# EasyEDA Pro project RackEth_rev_2.eprj

# Schematic RackEth
Board Name: RackEth; Create Date: 2024-12-09; Page Name: RackEth; Project Name: RackEth; Schematic Name: RackEth; Update Date: 2025-01-21; Company: EasyEDA.com; Drawn: EasyEDA; Page Size: A4; Part Number: JLCPCB-002; Reviewed: EasyEDA; Version: V0.1
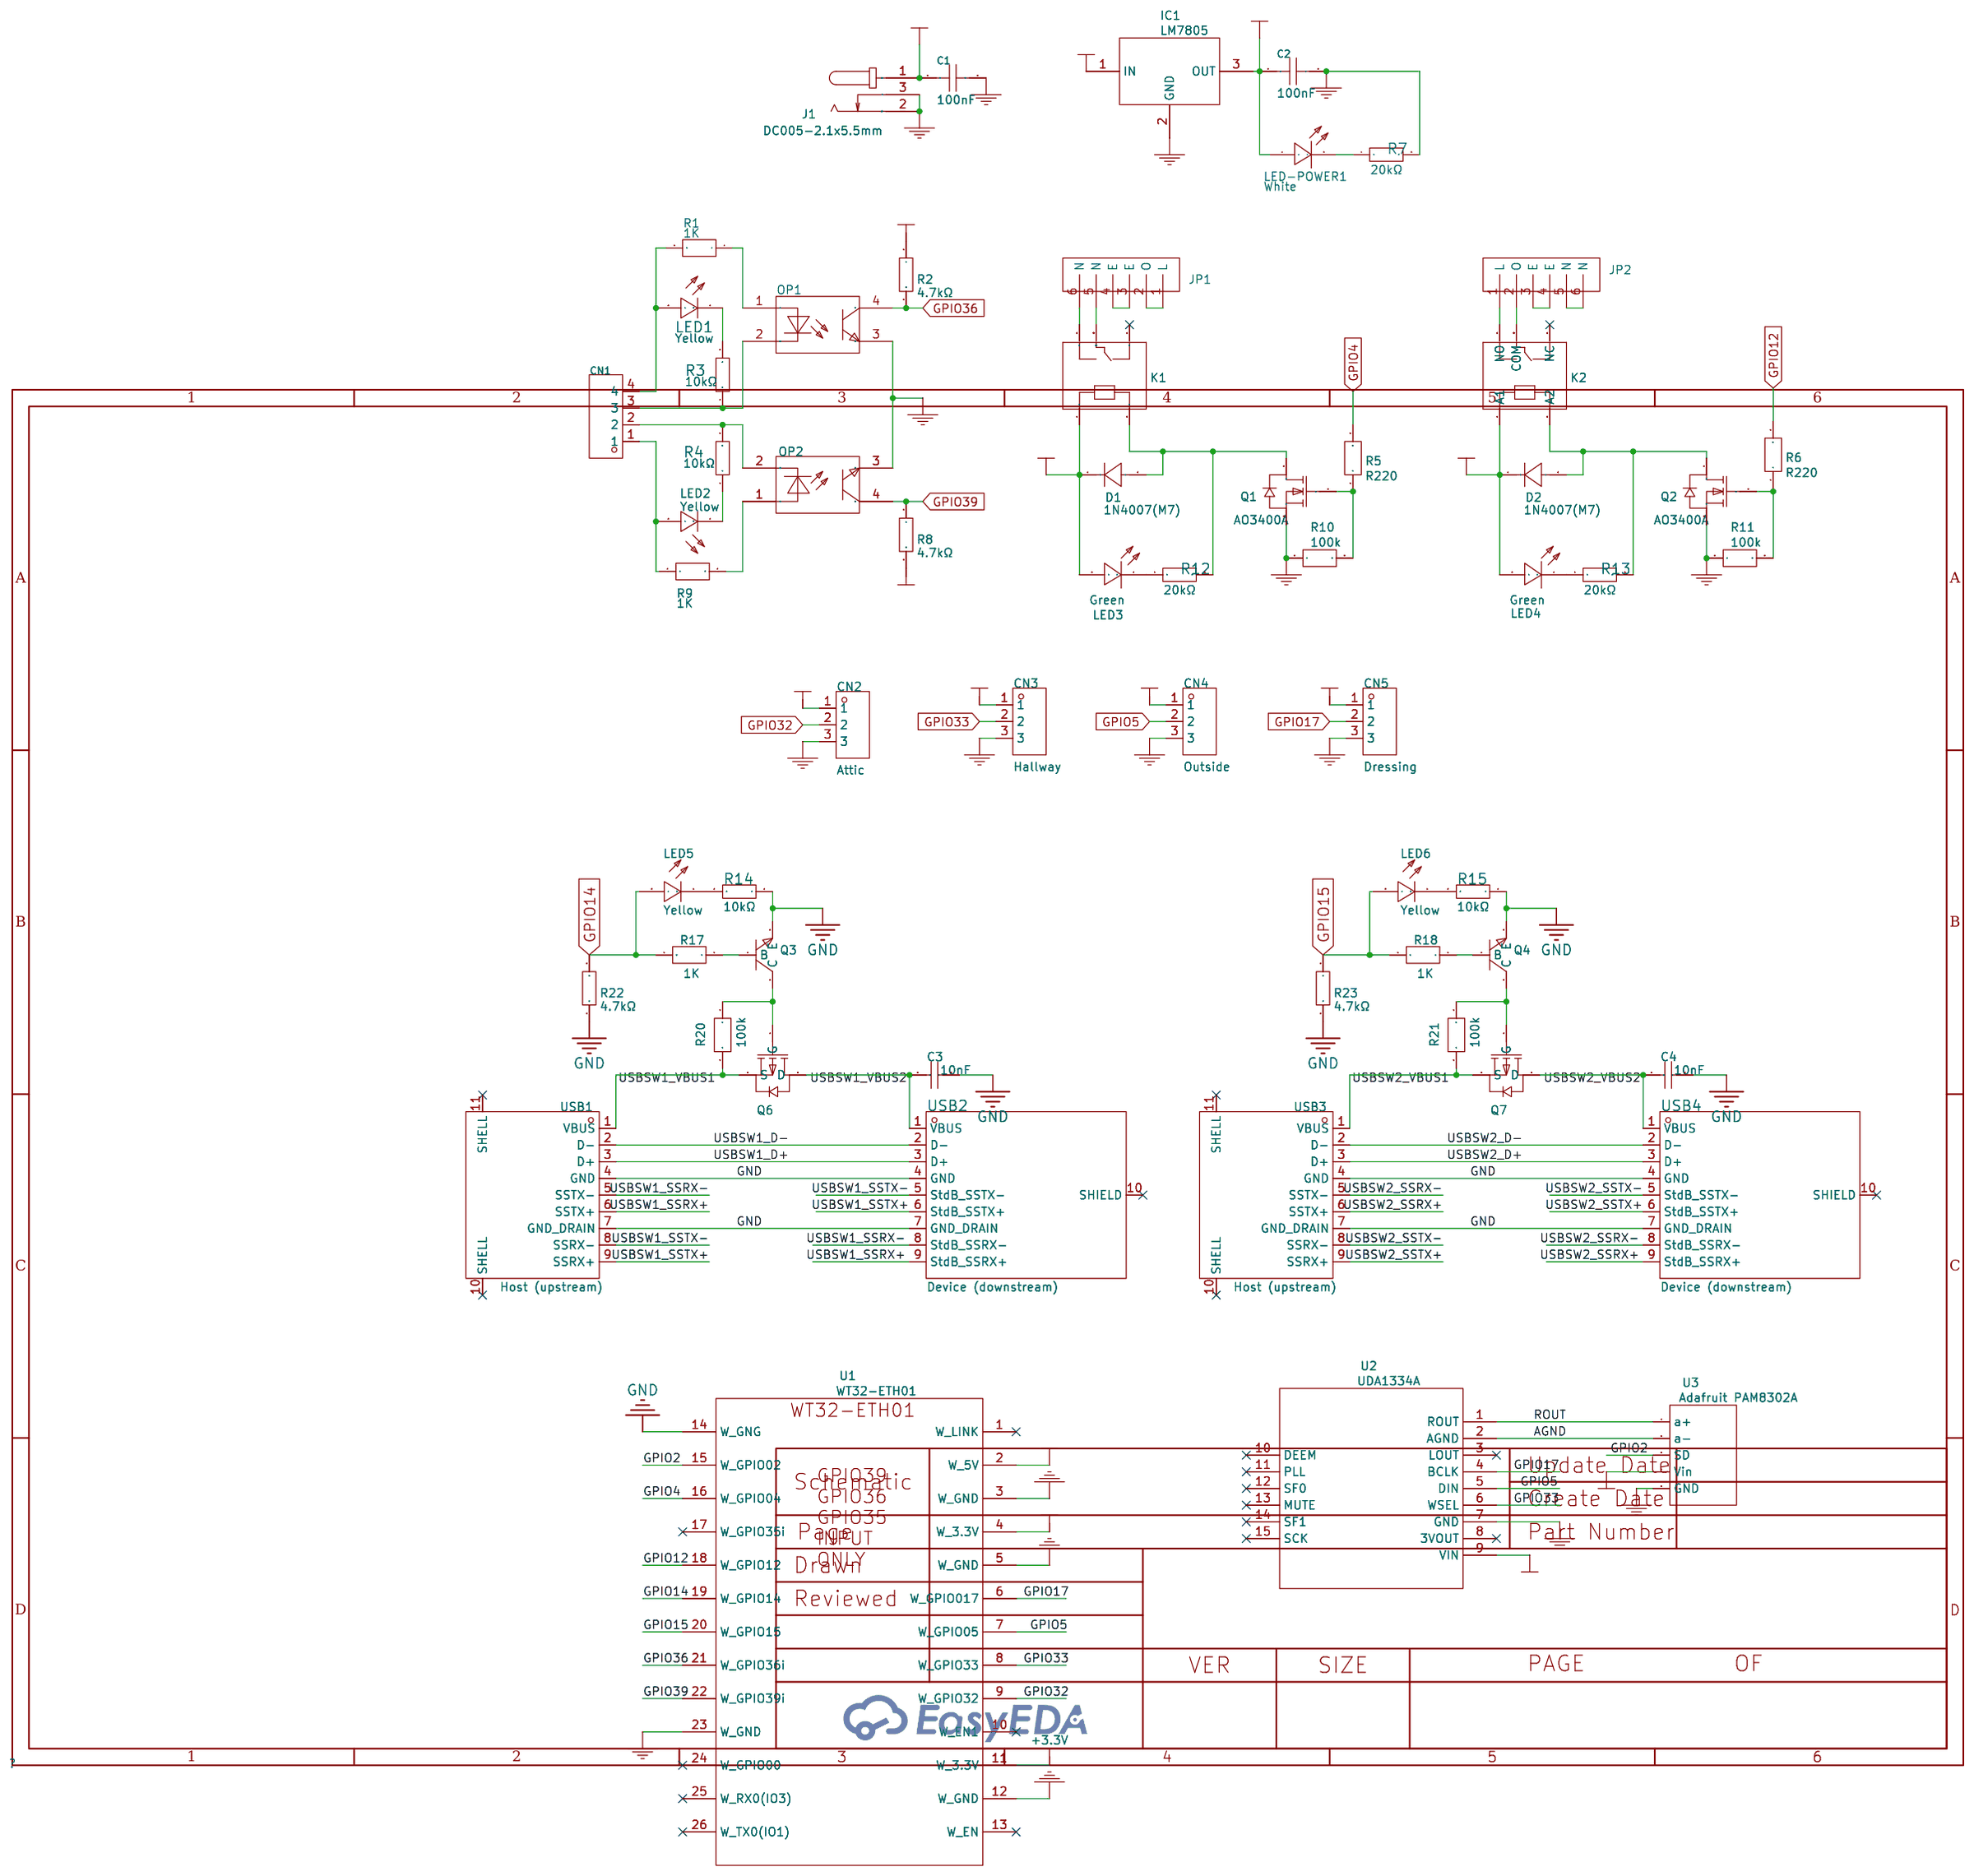
[diagram p0: schematic sheet]

## Parts
C1  100nF  [C0603]
C2  100nF  [C0603]
C3  10nF  [C0402]
C4  10nF  [C0402]
CN1  WJ127-5.0-4P  [CONN-TH_4P-P5.00_WJ127-5.0-4P]  (no BOM)
CN2  Attic  [CONN-TH_3P-P2.50_HCTL_XH-3A-L]  (no BOM)
CN3  Hallway  [CONN-TH_3P-P2.50_HCTL_XH-3A-L]  (no BOM)
CN4  Outside  [CONN-TH_3P-P2.50_HCTL_XH-3A-L]  (no BOM)
CN5  Dressing  [CONN-TH_3P-P2.50_HCTL_XH-3A-L]  (no BOM)
D1  1N4007(M7)  [SMA_L4.3-W2.7-LS5.1-RD]
D2  1N4007(M7)  [SMA_L4.3-W2.7-LS5.1-RD]
IC1  LM7805  [LM7805]  (no BOM)
J1  DC005-2.1x5.5mm  [DC-IN-TH_POWER-JACK]  (no BOM)
JP1  JP1  [CONN-TH_6P-P5.00_WJ127-5.0-6P]  (no BOM)
JP2  JP2  [CONN-TH_6P-P5.00_WJ127-5.0-6P]  (no BOM)
K1  Relay1  [SRD-05VDC-SL-C_RELAY_SRD-05VDC-SL-C]  (no BOM)
K2  Relay2  [SRD-05VDC-SL-C_RELAY_SRD-05VDC-SL-C]  (no BOM)
LED1  Yellow  [LED0603-RD-YELLOW]
LED2  Yellow  [LED0603-RD-YELLOW]
LED3  Green  [LED0805-RD_GREEN]
LED4  Green  [LED0805-RD_GREEN]
LED5  Yellow  [LED0603-RD-YELLOW]
LED6  Yellow  [LED0603-RD-YELLOW]
LED-POWER1  White  [LED0603-R-RD_WHITE]
OP1  EL817S1(C)(TU)-F  [OPTO-SMD-4_L4.6-W6.5-P2.54-LS10.3-TL]
OP2  EL817S1(C)(TU)-F  [OPTO-SMD-4_L4.6-W6.5-P2.54-LS10.3-TL]
Q1  AO3400A  [SOT-23-3_L2.9-W1.6-P1.90-LS2.8-BR]
Q2  AO3400A  [SOT-23-3_L2.9-W1.6-P1.90-LS2.8-BR]
Q3  MMBT3904(RANGE:100-300)  [SOT-23-3_L2.9-W1.3-P1.90-LS2.4-BR]
Q4  MMBT3904(RANGE:100-300)  [SOT-23-3_L2.9-W1.3-P1.90-LS2.4-BR]
Q6  AO3401A  [SOT-23_L2.9-W1.3-P1.90-LS2.4-BR]
Q7  AO3401A  [SOT-23_L2.9-W1.3-P1.90-LS2.4-BR]
R1  1K  [R0603]
R2  4.7kΩ  [R0603]
R3  10kΩ  [R0603]
R4  10kΩ  [R0603]
R5  R220  [R0603]
R6  R220  [R0603]
R7  20kΩ  [R0603]
R8  4.7kΩ  [R0603]
R9  1K  [R0603]
R10  100k  [R0603]
R11  100k  [R0603]
R12  20kΩ  [R0603]
R13  20kΩ  [R0603]
R14  10kΩ  [R0603]
R15  10kΩ  [R0603]
R17  1K  [R0603]
R18  1K  [R0603]
R20  100k  [R0603]
R21  100k  [R0603]
R22  4.7kΩ  [R0603]
R23  4.7kΩ  [R0603]
U1  WT32-ETH01  [WT32-ETH01-M]  (no BOM)
U2  UDA1334A  [UDA1334A_MODULE]  (no BOM)
U3  Adafruit PAM8302A  [ADAFRUIT PAM8302A]  (no BOM)
USB1  Host (upstream)  [USB3.0-TH_U235-09XN-2XC2-002]
USB2  Device (downstream)  [USB3.0-A-SMD_916-862A205EY10200]
USB3  Host (upstream)  [USB3.0-TH_U235-09XN-2XC2-002]
USB4  Device (downstream)  [USB3.0-A-SMD_916-862A205EY10200]

## Library data of the parts
C1 C2 = CC0603KRX7R9BB104: Capacitance: Tolerance:±10% Tolerance:±10% Voltage Rated: Temperature Coefficient:; LCSC Part Name: 100nF ±10% 50V; Supplier Part: C14663; Manufacturer: YAGEO(国巨); Supplier Footprint: 0603; JLCPCB Part Class: Basic Part; Datasheet: https://atta.szlcsc.com/upload/public/pdf/source/20180910/C282072_33301C7F631E79921B82A8DAC6BCC5B3.pdf; Supplier: LCSC; Tolerance: ±10%
C3 C4 = CL05B103KB5NNNC: Capacitance: Tolerance:±10% Tolerance:±10% Voltage Rated: Temperature Coefficient:; LCSC Part Name: 10nF ±10% 50V; Supplier Part: C15195; Manufacturer: SAMSUNG(三星); Supplier Footprint: 0402; JLCPCB Part Class: Basic Part; Datasheet: https://atta.szlcsc.com/upload/public/pdf/source/20160218/1457707763339.pdf; Supplier: LCSC; Tolerance: ±10%
CN1 = WJ127-5.0-4P: Structure:1x4P Pitch:5mm Color:Green Mounting Style:Straight Current Rating (Max):15A Voltage Rating (Max):250V Number of Pins:4P Number of Rows:1 Wire Gauge - AWG:14~26 Wire Gauge - AWG:14~26 Wire Gauge - mm2:1.5 Wire Gauge - mm2:1.5 Number of PINs Per R; LCSC Part Name: 5mm 1x4P 排数:1 每排P数:4 直插; Supplier Part: C192779; Manufacturer: KANGNEX(康奈克斯电气); Supplier Footprint: 插件,P=5mm; JLCPCB Part Class: Extended Part; Datasheet: https://atta.szlcsc.com/upload/public/pdf/source/20191225/C192779_DBD79F61C9FABD31EC3EFBBD98D95251.pdf; Supplier: LCSC; Structure: 1x4P; Pitch: 5mm; Color: Green; Mounting Style: Straight; Current Rating (Max): 15A; Voltage Rating (Max): 250V; Number of Pins: 4P; Number of Rows: 1; Wire Gauge - AWG: 14~26; Wire Gauge - mm2: 1.5; Number of PINs Per Row: 4; Operating Temperature Range: -40℃~+105℃
CN2-CN5 = XH2.54-3A: Supplier Part: C9900018379; Supplier: LCSC
D1 D2 = 1N4007(M7): Supplier: LCSC; Supplier Part: C2988638; Manufacturer: UMW(友台半导体); JLCPCB Part Class: Extended Part
IC1 = LM7805: sim: true
J1 = DC005-2.1x5.5mm: Supplier: LCSC; Supplier Part: C9900001795; Manufacturer: 索峰; Manufacturer Part: POWER-JACK; JLCPCB Part Class: Extended Part
JP1 JP2 = Terminal?: Supplier Part: 6P Terminal Block Connector 5.0mm; Supplier: Amazon; link: https://www.amazon.com/gp/product/B00NWEC8TW
K1 = Relay1: Supplier Part: SRD-05VDC-SL-C_SRD-05VDC-SL-C
K2 = Relay2: Supplier Part: SRD-05VDC-SL-C_SRD-05VDC-SL-C
LED1 LED2 LED5 LED6 = 19-213/Y2C-CQ2R2L/3T(CY): Emitted Color:Yellow Power Dissipation:60mW Forward Current:20mA Dominant Wavelength:585.5nm~591.5nm Dominant Wavelength:585.5nm~591.5nm Peak Wavelength:591nm Diode Configuration:- Lens Color:无色透明透镜 Color Temperature:- Color Temperature:- Viewing Angle:12; LCSC Part Name: 黄灯; Supplier Part: C72038; Manufacturer: EVERLIGHT(亿光); Supplier Footprint: 0603; JLCPCB Part Class: Basic Part; Datasheet: https://atta.szlcsc.com/upload/public/pdf/source/20160507/1462613613586.pdf; Supplier: LCSC; Power Dissipation: 60mW; Forward Current: 20mA; Dominant Wavelength: 585.5nm~591.5nm; Peak Wavelength: 591nm; Lens Color: 无色透明透镜; Viewing Angle: 120°; Operating Temperature: -40℃~+85℃
LED3 LED4 = 0805G (Green): Supplier: LCSC; Manufacturer: KENTO; Supplier Part: C2297; JLCPCB Part Class: Basic Part
LED-POWER1 = 0603White light_C2290: Supplier: LCSC; Manufacturer: KENTO; Manufacturer Part: KT-0603W; Supplier Part: C2290; JLCPCB Part Class: Basic Part
OP1 OP2 = EL817S1(C)(TU)-F: Supplier: LCSC; Manufacturer: EVERLIGHT(亿光); Supplier Part: C106900; JLCPCB Part Class: Basic Part
Q1 Q2 = AO3400A: Supplier: LCSC; Manufacturer: AOS; Supplier Part: C20917; JLCPCB Part Class: Basic Part
Q3 Q4 = MMBT3904(RANGE:100-300): Transistor Type: Collector Current (Ic): Collector-Emitter Breakdown Voltage (Vceo): Power Dissipation (Pd): DC Current Gain (hFE@Ic,Vce):100@10mA,1V DC Current Gain (hFE@Ic,Vce):100@10mA,1V Transition Frequency (fT):300MHz Collector Cut-Off Current (Icbo; LCSC Part Name: NPN 电流:200mA 耐压:40V hfe=100~300; Supplier Part: C20526; Manufacturer: CJ(江苏长电/长晶); Supplier Footprint: SOT-23; JLCPCB Part Class: Basic Part; Datasheet: https://atta.szlcsc.com/upload/public/pdf/source/20220704/70F575FB75061E03F919270A6BB8BA7F.pdf; Supplier: LCSC; DC Current Gain (hFE@Ic,Vce): 100@10mA,1V; Transition Frequency (fT): 300MHz; Collector Cut-Off Current (Icbo): 100nA; Collector-Emitter Saturation Voltage (VCE(sat)@Ic,Ib): 300mV@50mA,5mA
Q6 Q7 = AO3401A_C15127: Type:1 Piece P-Channel Drain Source Voltage (Vdss): Continuous Drain Current (Id): Drain Source On Resistance (RDS(on)@Vgs,Id):44mΩ@10V,4.3A Power Dissipation (Pd): Gate Threshold Voltage (Vgs(th)@Id):1.3V@250uA Total Gate Charge (Qg@Vgs):12.2nC@4.5V Inpu; LCSC Part Name: 1个P沟道 耐压:30V 电流:4A; Supplier Part: C15127; Manufacturer: AOS; Supplier Footprint: SOT-23; JLCPCB Part Class: Basic Part; Datasheet: https://atta.szlcsc.com/upload/public/pdf/source/20160507/1462613609053.pdf; Supplier: LCSC; Type: 1 Piece P-Channel; Drain Source On Resistance (RDS(on)@Vgs,Id): 44mΩ@10V,4.3A; Gate Threshold Voltage (Vgs(th)@Id): 1.3V@250uA; Total Gate Charge (Qg@Vgs): 12.2nC@4.5V; Input Capacitance (Ciss@Vds): 1.2nF@15V; Operating Temperature: -55℃~+150℃@(Tj)
R1 R9 R17 R18 = 1K: Supplier Part: C21190; Supplier: LCSC; Manufacturer Part: 0603WAF1001T5E; Manufacturer: UNI-ROYAL(厚声)
R2 R8 R22 R23 = 0603WAF4701T5E: Type:Thick Film Resistors Resistance:4.7kΩ Tolerance:±1% Tolerance:±1% Power(Watts): Overload Voltage (Max): Temperature Coefficient:±100ppm/℃ Temperature Coefficient:±100ppm/℃ Operating Temperature Range:-55℃~+155℃ Operating Temperature Range:-55℃~+155℃; LCSC Part Name: 4.7kΩ ±1% 100mW 厚膜电阻; Supplier Part: C23162; Manufacturer: UNI-ROYAL(厚声); Supplier Footprint: 0603; JLCPCB Part Class: Basic Part; Datasheet: https://atta.szlcsc.com/upload/public/pdf/source/20200306/C422600_1E6D84923E4A46A82E41ADD87F860B5C.pdf; Supplier: LCSC; Type: Thick Film Resistors; Tolerance: ±1%; Temperature Coefficient: ±100ppm/℃; Operating Temperature Range: -55℃~+155℃
R3 R4 R14 R15 = 0603WAF1002T5E: Type:Thick Film Resistors Resistance:10kΩ Tolerance:±1% Tolerance:±1% Power(Watts): Overload Voltage (Max): Temperature Coefficient:±100ppm/℃ Temperature Coefficient:±100ppm/℃ Operating Temperature Range:-55℃~+155℃ Operating Temperature Range:-55℃~+155℃; LCSC Part Name: 厚膜电阻 10kΩ ±1% 100mW; Supplier Part: C25804; Manufacturer: UNI-ROYAL(厚声); Supplier Footprint: 0603; JLCPCB Part Class: Basic Part; Datasheet: https://atta.szlcsc.com/upload/public/pdf/source/20200306/C422600_1E6D84923E4A46A82E41ADD87F860B5C.pdf; Supplier: LCSC; Type: Thick Film Resistors; Tolerance: ±1%; Temperature Coefficient: ±100ppm/℃; Operating Temperature Range: -55℃~+155℃
R5 R6 = R220: Supplier Part: C22962; Supplier: LCSC; Manufacturer Part: 0603WAF2200T5E; Manufacturer: UNI-ROYAL(厚声)
R7 R12 R13 = 0603WAF2002T5E: Type:Thick Film Resistors Resistance:20kΩ Tolerance:±1% Tolerance:±1% Power(Watts): Overload Voltage (Max): Temperature Coefficient:±100ppm/℃ Temperature Coefficient:±100ppm/℃ Operating Temperature Range:-55℃~+155℃ Operating Temperature Range:-55℃~+155℃; LCSC Part Name: 20kΩ ±1% 100mW 厚膜电阻; Supplier Part: C4184; Manufacturer: UNI-ROYAL(厚声); Supplier Footprint: 0603; JLCPCB Part Class: Basic Part; Datasheet: https://atta.szlcsc.com/upload/public/pdf/source/20200306/C422600_1E6D84923E4A46A82E41ADD87F860B5C.pdf; Supplier: LCSC; Type: Thick Film Resistors; Tolerance: ±1%; Temperature Coefficient: ±100ppm/℃; Operating Temperature Range: -55℃~+155℃
R10 R11 R20 R21 = 100k: Supplier Part: C25803; Supplier: LCSC; Manufacturer Part: 0603WAF1003T5E; Manufacturer: UNI-ROYAL(厚声)
U1 = WT32-ETH01: Manufacturer: Wireless-Tag; link: http://www.wireless-tag.com/wp-content/uploads/2020/08/WT32-ETH01规格书V1.2EN（英文）.pdf
U2 = UDA1334A module
U3 = Adafruit PAM8302A
USB1 USB3 = U235-091N-2UC2-002: Connector Type:Type-B Standard:- Gender:Female Mounting Style:- Number of Contacts:9P Number of Ports:1 Current Rating - Power (Max):1.8A Contact Material:Copper alloy Contact Plating:Gold Operating Temperature Range:-55℃~+85℃ Operating Temperature Range:; LCSC Part Name: Type-B 母; Supplier Part: C2879842; Manufacturer: XKB Connection(中国星坤); Supplier Footprint: 插件; JLCPCB Part Class: Extended Part; Datasheet: https://atta.szlcsc.com/upload/public/pdf/source/20220919/F7A9F5F63B3D22A8342A73DEDBEAF374.pdf; Supplier: LCSC; Connector Type: Type-B; Gender: Female; Number of Contacts: 9P; Number of Ports: 1; Current Rating - Power (Max): 1.8A; Contact Material: Copper alloy; Contact Plating: Gold; Operating Temperature Range: -55℃~+85℃; Soldering Temperature(Max): 235℃
USB2 USB4 = 916-862A205EY10200: Connector Type:Type-A Standard:USB 3.0 Gender:Female Number of Ports:1 Number of Contacts:9P Mounting Style:Board Edge, Straddle Mount Current Rating - Power (Max):1A Operating Temperature Range:-25℃~+85℃ Operating Temperature Range:-25℃~+85℃; LCSC Part Name: Type-A 母 夹板; Supplier Part: C2763055; Manufacturer: 精拓金; Supplier Footprint: SMD; JLCPCB Part Class: Extended Part; Datasheet: https://atta.szlcsc.com/upload/public/pdf/source/20210526/C2763055_64B60A99F4A404C7F2E7F9F6F4497CDD.pdf; Supplier: LCSC; Connector Type: Type-A; Standard: USB 3.0; Gender: Female; Number of Ports: 1; Number of Contacts: 9P; Mounting Style: Board Edge, Straddle Mount; Current Rating - Power (Max): 1A; Operating Temperature Range: -25℃~+85℃

## Nets
+3.3V: CN2.1 CN3.1 CN4.1 CN5.1 U1.11(W_3.3V)
+3.3V_2: R2.1 R8.2 U1.4(W_3.3V)
+5V: C2.1 D1.1(K) D2.1(K) IC1.3(OUT) K1.A1 K2.A1 LED3.2(A) LED4.2(A) LED-POWER1.1(A) U1.2(W_5V) U2.9(VIN) U3.4(Vin)
AGND: U2.2(AGND) U3.2(a-)
GND: C1.2 C2.2 C3.1 C4.1 CN2.3 CN3.3 CN4.3 CN5.3 IC1.2(GND) J1.2(GND) J1.3 OP1.3(EM) OP2.3(EM) Q1.2(S) Q2.2(S) Q3.2(E) Q4.2(E) R7.2 R10.1 R11.1 R14.1 R15.1 R22.2 R23.2 U1.3(W_GND) U1.5(W_GND) U1.12(W_GND) U1.14(W_GNG) U1.23(W_GND) U2.7(GND) U3.5(GND) USB1.4(GND) USB1.7(GND_DRAIN) USB2.4(GND) USB2.7(GND_DRAIN) USB3.4(GND) USB3.7(GND_DRAIN) USB4.4(GND) USB4.7(GND_DRAIN)
VCC: C1.1 IC1.1(IN) J1.1(VCC)
GPIO2: U1.15(W_GPIO02) U3.3(SD)
GPIO4: R5.2 U1.16(W_GPIO04)
GPIO5: CN4.2 U1.7(W_GPIO05) U2.5(DIN)
GPIO12: R6.2 U1.18(W_GPIO12)
GPIO14: LED5.2(A) R17.2 R22.1 U1.19(W_GPIO14)
GPIO15: LED6.2(A) R18.2 R23.1 U1.20(W_GPIO15)
GPIO17: CN5.2 U1.6(W_GPIO017) U2.4(BCLK)
GPIO32: CN2.2 U1.9(W_GPIO32)
GPIO33: CN3.2 U1.8(W_GPIO33) U2.6(WSEL)
GPIO36: OP1.4(COL) R2.2 U1.21(W_GPIO36i)
GPIO39: OP2.4(COL) R8.1 U1.22(W_GPIO39i)
ROUT: U2.1(ROUT) U3.1(a+)
USBSW1_D+: USB1.3(D+) USB2.3(D+)
USBSW1_D-: USB1.2(D-) USB2.2(D-)
USBSW1_SSRX+: USB1.6(SSTX+) USB2.9(StdB_SSRX+)
USBSW1_SSRX-: USB1.5(SSTX-) USB2.8(StdB_SSRX-)
USBSW1_SSTX+: USB1.9(SSRX+) USB2.6(StdB_SSTX+)
USBSW1_SSTX-: USB1.8(SSRX-) USB2.5(StdB_SSTX-)
USBSW1_VBUS1: Q6.2(S) R20.2 USB1.1(VBUS)
USBSW1_VBUS2: C3.2 Q6.3(D) USB2.1(VBUS)
USBSW2_D+: USB3.3(D+) USB4.3(D+)
USBSW2_D-: USB3.2(D-) USB4.2(D-)
USBSW2_SSRX+: USB3.6(SSTX+) USB4.9(StdB_SSRX+)
USBSW2_SSRX-: USB3.5(SSTX-) USB4.8(StdB_SSRX-)
USBSW2_SSTX+: USB3.9(SSRX+) USB4.6(StdB_SSTX+)
USBSW2_SSTX-: USB3.8(SSRX-) USB4.5(StdB_SSTX-)
USBSW2_VBUS1: Q7.2(S) R21.2 USB3.1(VBUS)
USBSW2_VBUS2: C4.2 Q7.3(D) USB4.1(VBUS)
$1N3: D1.2(A) K1.A2 Q1.3(D) R12.2
$1N5: Q1.1(G) R5.1 R10.2
$1N16: LED-POWER1.2(K) R7.1
$1N18: D2.2(A) K2.A2 Q2.3(D) R13.2
$1N19: LED4.1(K) R13.1
$1N25: Q2.1(G) R6.1 R11.2
$1N58: OP1.1(AN) R1.1
$1N59: CN1.4 LED1.2(A) R1.2
$1N4552: JP2.3(E) JP2.4(E)
$1N4588: JP1.6(N) K1.NO
$1N4592: JP1.5(N) K1.COM
$1N4597: JP1.3(E) JP1.4(E)
$1N4602: JP1.1(L) JP1.2(O)
$1N4658: JP2.2(O) K2.COM
$1N4661: JP2.1(L) K2.NO
$1N4663: JP2.5(N) JP2.6(N)
$1N12669: CN1.3 OP1.2(CAT) R3.1
$1N27876: CN1.2 OP2.2(CAT) R4.2
$1N27969: LED1.1(C) R3.2
$1N27997: CN1.1 LED2.2(A) R9.1
$1N28002: OP2.1(AN) R9.2
$1N28006: LED2.1(C) R4.1
$1N30826: LED3.1(K) R12.1
$1N38985: Q3.1(B) R17.1
$1N38986: Q3.3(C) Q6.1(G) R20.1
$1N41846: Q4.1(B) R18.1
$1N41847: Q4.3(C) Q7.1(G) R21.1
$1N49685: LED5.1(C) R14.2
$1N49709: LED6.1(C) R15.2

Not connected (* = marked no-connect by the designer): K1 NC*; K2 NC*; U1 1(W_LINK)* 10(W_EN1)* 13(W_EN)* 17(W_GPIO35i)* 24(W_GPIO00)* 25(W_RX0(IO3))* 26(W_TX0(IO1))*; U2 3(LOUT)* 8(3VOUT)* 10(DEEM)* 11(PLL)* 12(SF0)* 13(MUTE)* 14(SF1)* 15(SCK)*; USB1 10(SHELL)* 11(SHELL)*; USB2 10(SHIELD)*; USB3 10(SHELL)* 11(SHELL)*; USB4 10(SHIELD)*

# Board RackEth
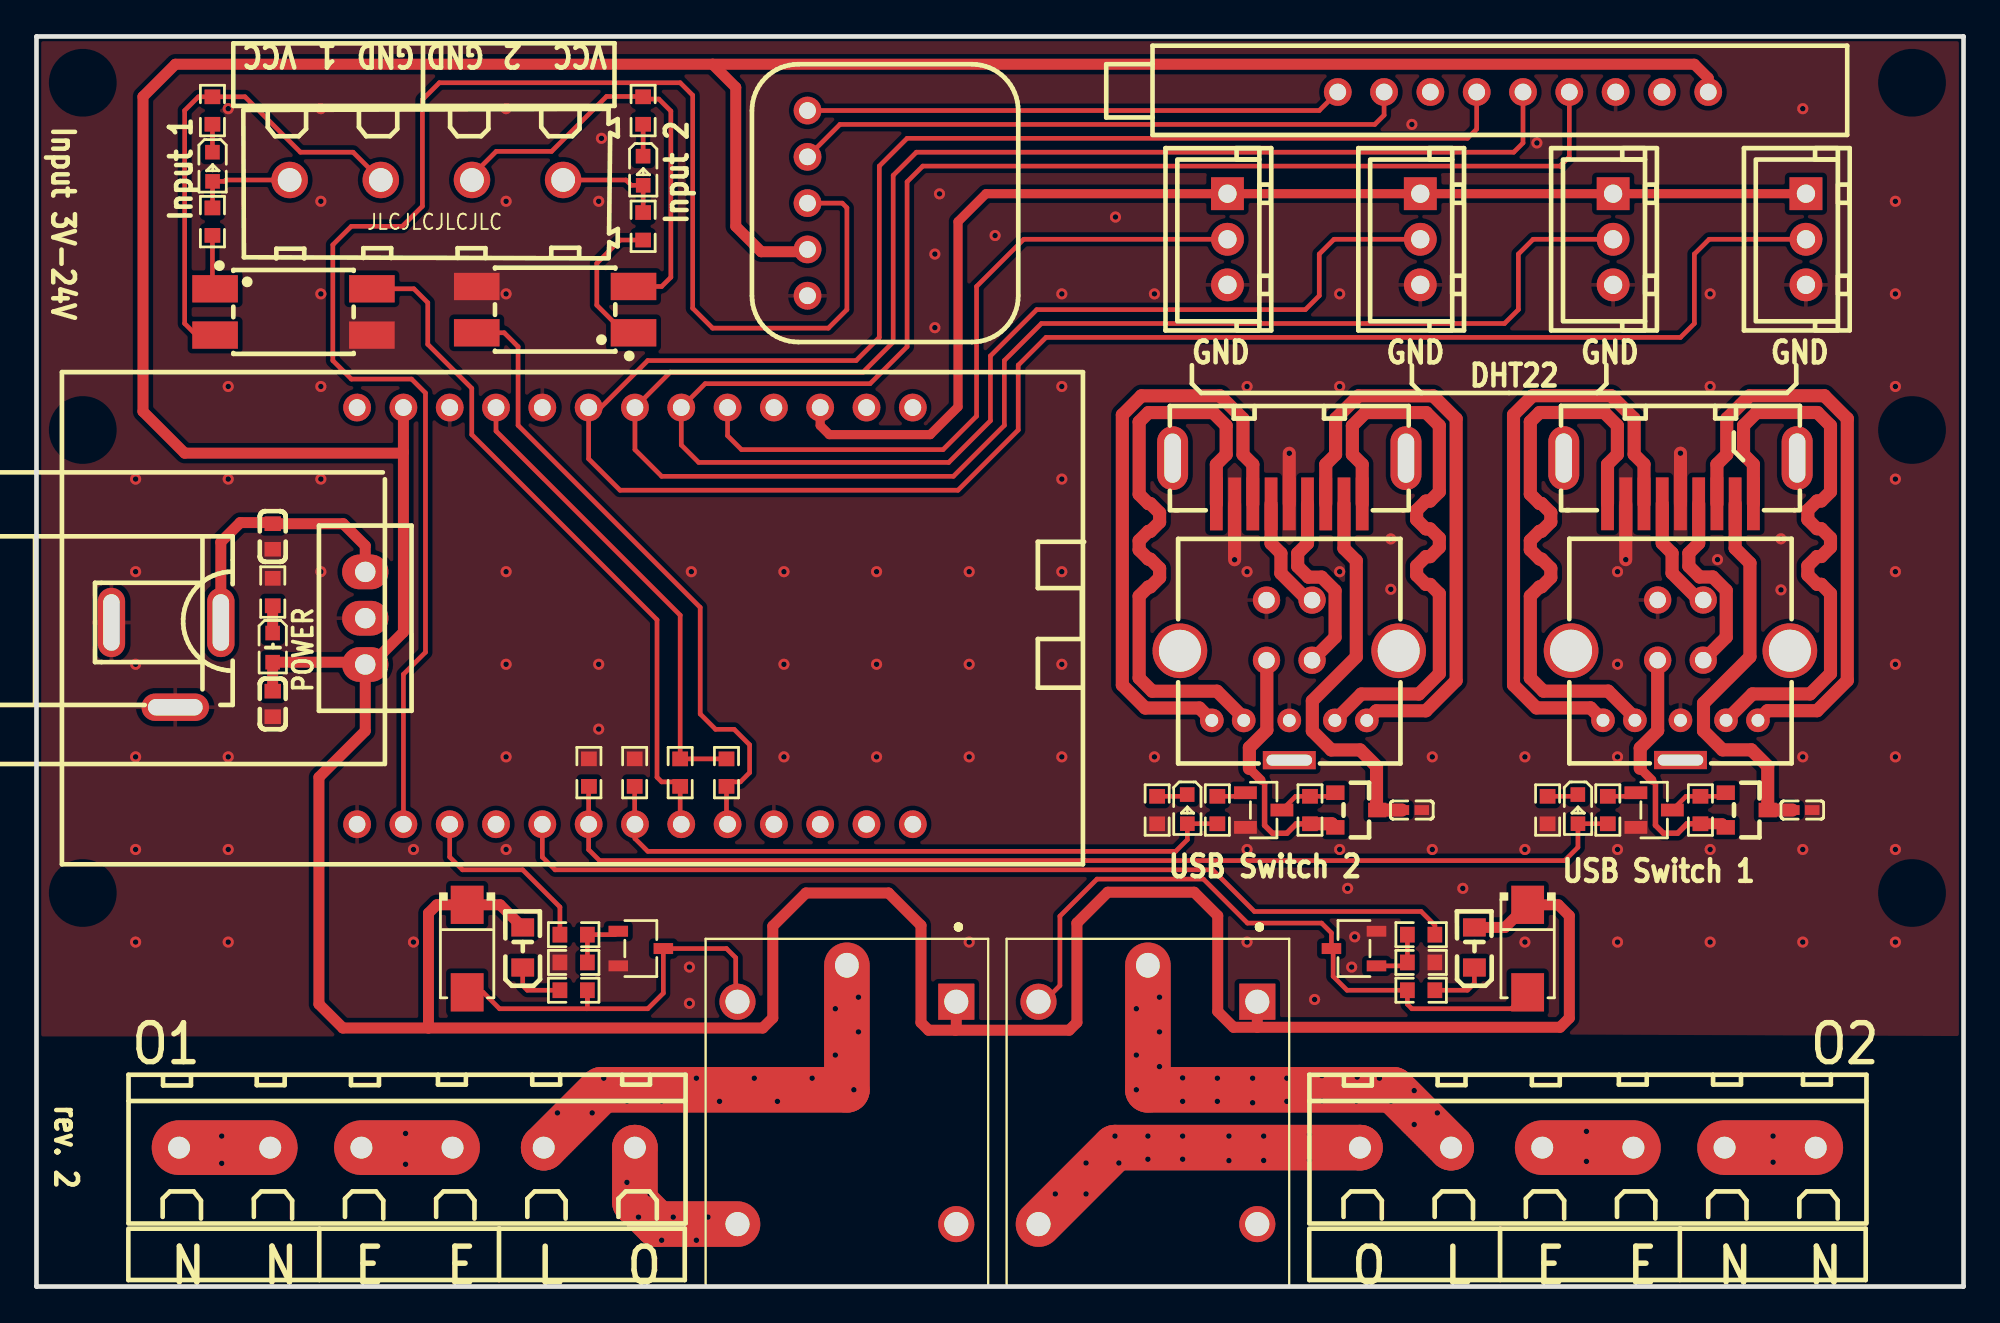
[diagram p1: board, top side]
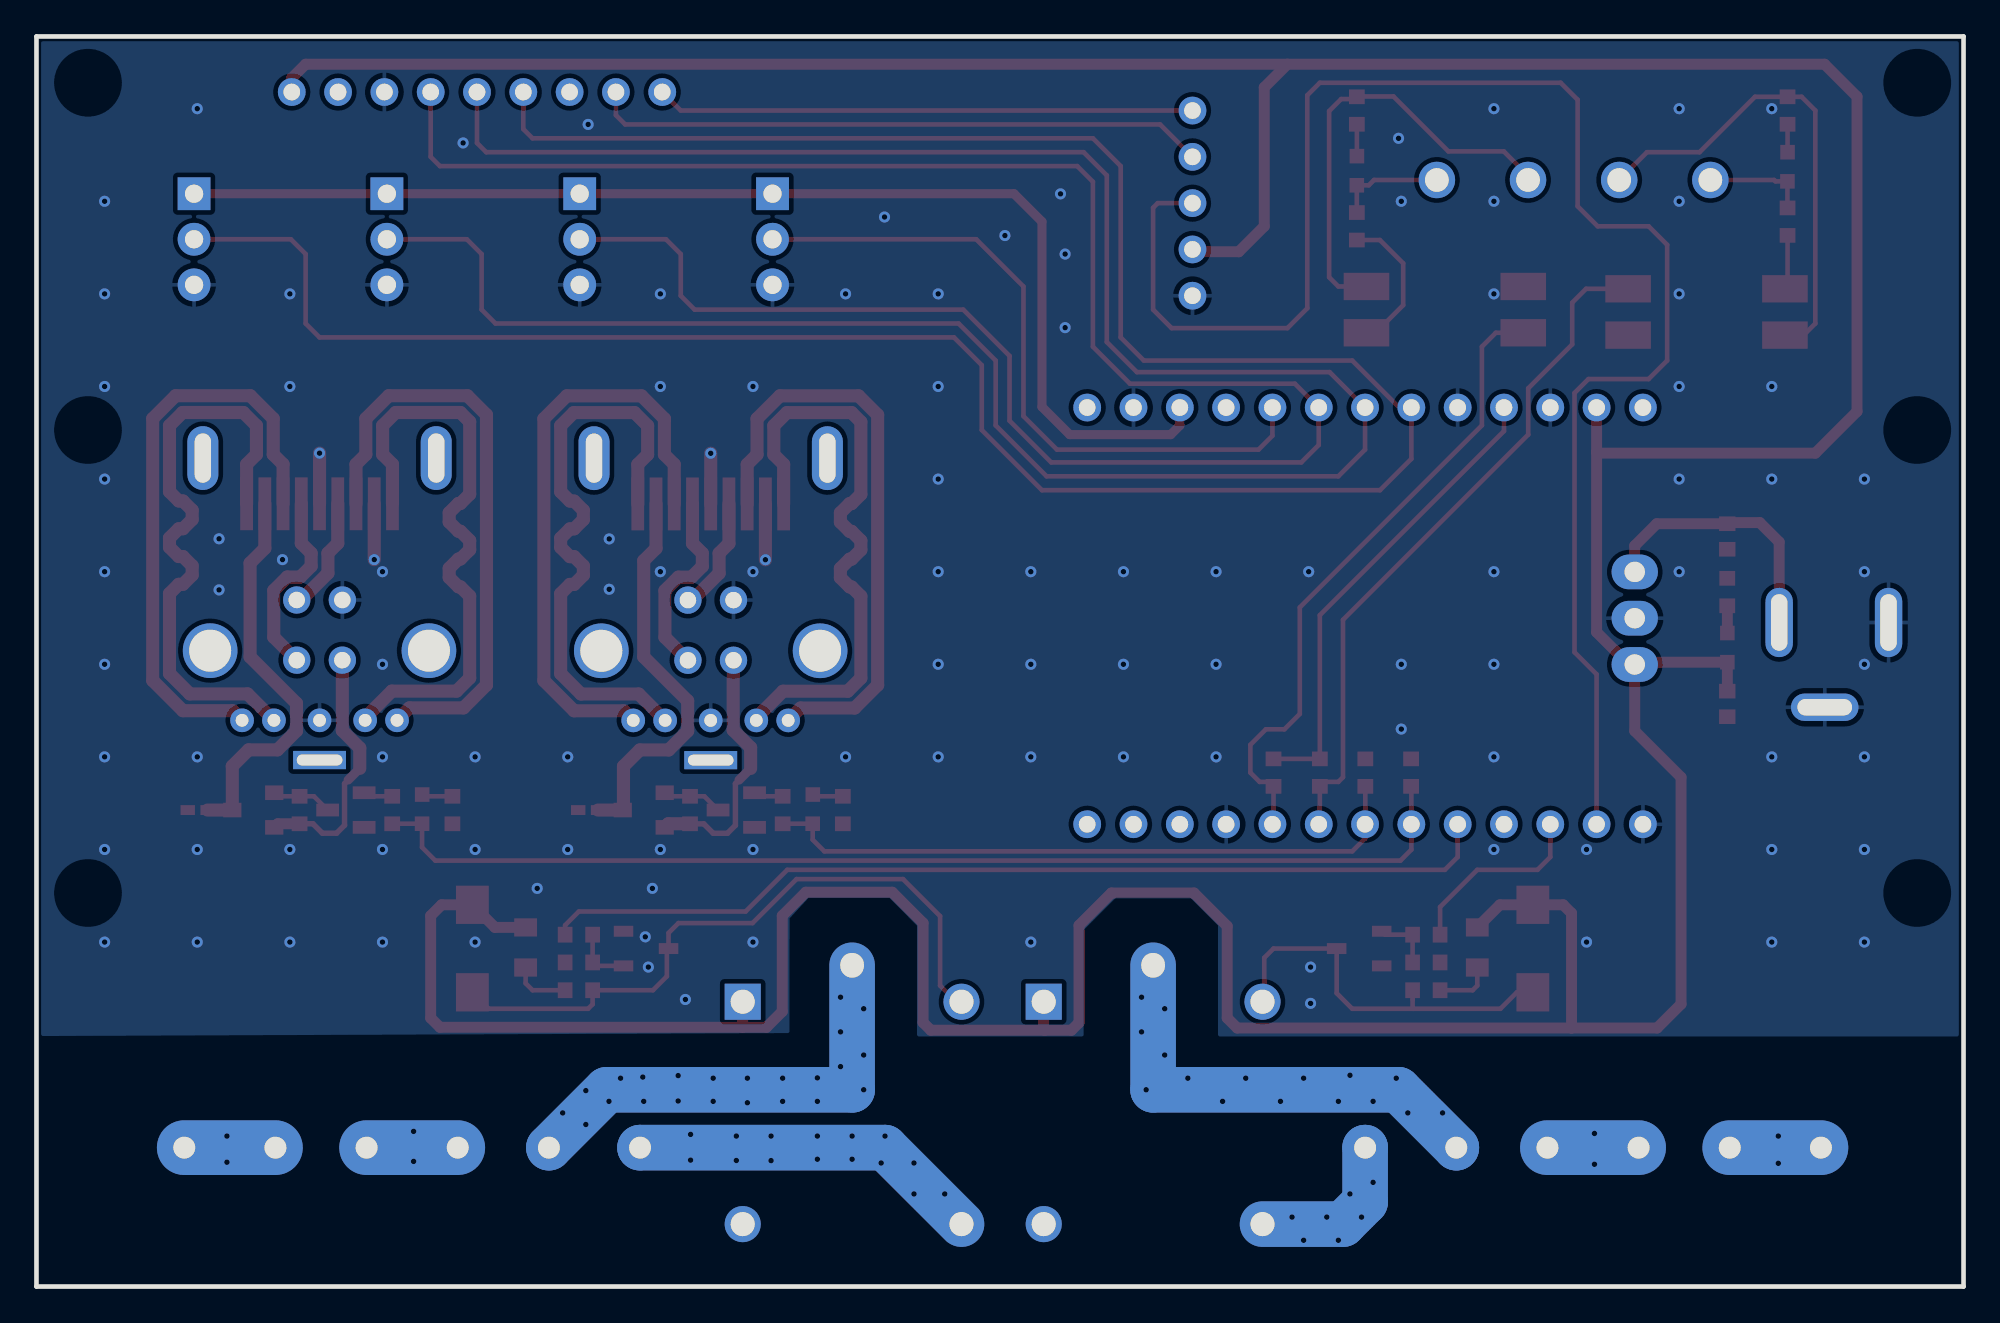
[diagram p2: board, bottom side, seen from below]

Outline 105.7 x 68.58 mm; copper layers: Top Layer, Bottom Layer. Coordinates in mm from the lower left corner of the outline.
Outline path: 0,68.58 105.7,68.58 105.7,0 0,0 0,68.58
Stack: Top Layer 0.035mm / Dielectric1 1.51mm FR4 er 4.5 / Bottom Layer 0.035mm

## Design rules (mm)
net USBSW1_D-: USBSW1_D
net USBSW1_D+: USBSW1_D
net USBSW1_SSTX+: USBSW1_SSTX
net USBSW1_SSTX-: USBSW1_SSTX
net USBSW1_SSRX+: USBSW1_SSRX
net USBSW1_SSRX-: USBSW1_SSRX
net USBSW2_D-: USBSW2_D
net USBSW2_D+: USBSW2_D
net USBSW2_SSTX+: USBSW2_SSTX
net USBSW2_SSTX-: USBSW2_SSTX
net USBSW2_SSRX+: USBSW2_SSRX
net USBSW2_SSRX-: USBSW2_SSRX
template: GME Two Layers
spacing copperThickness1oz (default): track to track 0.127, other pairs 0.152 to 0.3
spacing copperThickness2oz: track to track 0.203, other pairs 0.152 to 0.3
spacing copperThicknessInner0.5oz: track to track 0.089, other pairs 0.152 to 0.3
track width copperThickness1oz (default): min 0.102, default 0.254, max 5
track width copperThickness0.5oz: min 0.089, default 0.254, max 2.54
track width copperThickness2oz: min 0.203, default 0.254, max 2.54
differential pair differentialPair (default): width min 0.718, default 0.718, max 0.718; gap min 0.203, default 0.203
differential pair differentialPair-USB2: width min 0.127, default 0.254, max 2.54; gap min 0.152, default 0.152
via viaSize (default): diameter min 0.3, default 0.61, max 10; hole min 0.2, default 0.305, max 6.3
net USBSW1_D- uses differentialPair-USB2
net USBSW1_D+ uses differentialPair-USB2
net USBSW2_D- uses differentialPair-USB2
net USBSW2_D+ uses differentialPair-USB2
diff pair USBSW1_D uses differentialPair-USB2
diff pair USBSW2_D uses differentialPair-USB2

## Placement (name value [footprint] x y rotation side)
C1  100nF  [C0603]  12.96 41.15 270 top
C2  100nF  [C0603]  12.96 31.96 270 top
C3  10nF  [C0402]  96.85 26.14 180 top
C4  10nF  [C0402]  75.44 26.14 180 top
CN1  WJ127-5.0-4P  [CONN-TH_4P-P5.00_WJ127-5.0-4P]  21.39 60.71 180 top
CN2  Attic  [CONN-TH_3P-P2.50_HCTL_XH-3A-L]  65.32 57.45 90 top
CN3  Hallway  [CONN-TH_3P-P2.50_HCTL_XH-3A-L]  75.9 57.45 90 top
CN4  Outside  [CONN-TH_3P-P2.50_HCTL_XH-3A-L]  86.48 57.45 90 top
CN5  Dressing  [CONN-TH_3P-P2.50_HCTL_XH-3A-L]  97.05 57.45 90 top
D1  1N4007(M7)  [SMA_L4.3-W2.7-LS5.1-RD]  23.62 18.54 270 top
D2  1N4007(M7)  [SMA_L4.3-W2.7-LS5.1-RD]  81.79 18.54 270 top
IC1  -  [LM7805]  18.03 36.67 270 top
J1  DC005-2.1x5.5mm  [DC-IN-TH_POWER-JACK]  7.11 34.11 0 top
JP1  JP1  [CONN-TH_6P-P5.00_WJ127-5.0-6P]  20.32 7.62 0 top
JP2  JP2  [CONN-TH_6P-P5.00_WJ127-5.0-6P]  85.09 7.62 0 top
K1  Relay1  [SRD-05VDC-SL-C_RELAY_SRD-05VDC-SL-C]  44.45 9.53 270 top
K2  Relay2  [SRD-05VDC-SL-C_RELAY_SRD-05VDC-SL-C]  60.96 9.53 270 top
LED1  Yellow  [LED0603-RD-YELLOW]  9.66 61.43 270 top
LED2  Yellow  [LED0603-RD-YELLOW]  33.27 61.21 270 top
LED3  Green  [LED0805-RD_GREEN]  26.67 18.6 270 top
LED4  Green  [LED0805-RD_GREEN]  78.87 18.6 270 top
LED5  Yellow  [LED0603-RD-YELLOW]  84.54 26.19 270 top
LED6  Yellow  [LED0603-RD-YELLOW]  63.12 26.19 270 top
LED-POWER1  White  [LED0603-R-RD_WHITE]  12.95 35.05 270 top
OP1  EL817S1(C)(TU)-F  [OPTO-SMD-4_L4.6-W6.5-P2.54-LS10.3-TL]  14.1 53.47 0 top
OP2  EL817S1(C)(TU)-F  [OPTO-SMD-4_L4.6-W6.5-P2.54-LS10.3-TL]  28.45 53.59 180 top
Q1  AO3400A  [SOT-23-3_L2.9-W1.6-P1.90-LS2.8-BR]  33.15 18.54 0 top
Q2  AO3400A  [SOT-23-3_L2.9-W1.6-P1.90-LS2.8-BR]  72.26 18.54 180 top
Q3  MMBT3904(RANGE:100-300)  [SOT-23-3_L2.9-W1.3-P1.90-LS2.4-BR]  88.72 26.14 180 top
Q4  MMBT3904(RANGE:100-300)  [SOT-23-3_L2.9-W1.3-P1.90-LS2.4-BR]  67.31 26.14 180 top
Q6  AO3401A  [SOT-23_L2.9-W1.3-P1.90-LS2.4-BR]  93.81 26.14 180 top
Q7  AO3401A  [SOT-23_L2.9-W1.3-P1.90-LS2.4-BR]  72.39 26.14 180 top
R1  1K  [R0603]  9.65 58.42 90 top
R2  4.7kΩ  [R0603]  35.31 28.19 270 top
R3  10kΩ  [R0603]  9.65 64.52 270 top
R4  10kΩ  [R0603]  33.27 64.52 90 top
R5  R220  [R0603]  29.46 19.3 180 top
R6  R220  [R0603]  75.95 19.3 0 top
R7  20kΩ  [R0603]  12.96 38.1 90 top
R8  4.7kΩ  [R0603]  37.85 28.19 90 top
R9  1K  [R0603]  33.27 58.17 270 top
R10  100k  [R0603]  29.46 17.78 0 top
R11  100k  [R0603]  75.95 17.78 180 top
R12  20kΩ  [R0603]  29.46 16.26 0 top
R13  20kΩ  [R0603]  75.95 16.26 180 top
R14  10kΩ  [R0603]  82.88 26.14 90 top
R15  10kΩ  [R0603]  61.47 26.14 90 top
R17  1K  [R0603]  86.19 26.14 270 top
R18  1K  [R0603]  64.77 26.14 270 top
R20  100k  [R0603]  91.26 26.14 270 top
R21  100k  [R0603]  69.85 26.14 270 top
R22  4.7kΩ  [R0603]  30.3 28.19 90 top
R23  4.7kΩ  [R0603]  32.81 28.19 90 top
U1  WT32-ETH01  [WT32-ETH01-M]  31.12 36.19 0 top
U2  UDA1334A  [UDA1334A_MODULE]  78.99 68.07 180 top
U3  Adafruit PAM8302A  [ADAFRUIT PAM8302A]  52.83 53.59 0 top
USB1  Host (upstream)  [USB3.0-TH_U235-09XN-2XC2-002]  90.17 33.27 180 top
USB2  Device (downstream)  [USB3.0-A-SMD_916-862A205EY10200]  90.17 44.2 180 top
USB3  Host (upstream)  [USB3.0-TH_U235-09XN-2XC2-002]  68.72 33.27 180 top
USB4  Device (downstream)  [USB3.0-A-SMD_916-862A205EY10200]  68.72 44.19 180 top

## Footprints (pads in the part's own frame, mm; a bottom-side part is the same pattern mirrored in y, then rotated)
ADAFRUIT PAM8302A
  round 1.524 hole 0.914: 1(-10.541,10.922) 2(-10.541,8.382) 3(-10.541,5.842) 4(-10.541,3.302) 5(-10.541,0.762)
C0402
  rect 0.79x0.54 smd: 1(-0.545,0) 2(0.545,0)
C0603
  rect 0.8x0.9 smd: 1(-0.7,0) 2(0.7,0)
CONN-TH_3P-P2.50_HCTL_XH-3A-L
  rect 1.8x1.8 hole 1: 1(2.5,0)
  round 1.8 hole 1: 2(0,0) 3(-2.5,0)
CONN-TH_4P-P5.00_WJ127-5.0-4P
  round 2 hole 1.3: 1(-7.5,0) 2(-2.5,0) 3(2.5,0) 4(7.5,0)
CONN-TH_6P-P5.00_WJ127-5.0-6P
  round 2.5 hole 1.2: 1(-12.5,0) 2(-7.5,0) 3(-2.5,0) 4(2.5,0) 5(7.5,0) 6(12.5,0)
DC-IN-TH_POWER-JACK
  oval 1.5x3.8 hole 0.9x3.1: 1(3,2.325) 2(-2.999,2.325)
  oval 3.7x1.5 hole 3x0.9: 3(0.5,-2.325)
LED0603-R-RD_WHITE
  rect 0.8x0.8 smd: 1(0.8,0) 2(-0.8,0)
LED0603-RD-YELLOW
  rect 0.8x0.8 smd: 1(-0.799,-0.004) 2(0.799,0.004)
LED0805-RD_GREEN
  rect 1x1.25 smd: 1(1.1,0) 2(-1.099,0)
LM7805
  oval 1.905x2.54 hole 1.117: 1(-2.54,0) 2(0,0) 3(2.54,0)
OPTO-SMD-4_L4.6-W6.5-P2.54-LS10.3-TL
  rect 2.5x1.5 smd: 1(-4.3,1.27) 2(-4.3,-1.27) 3(4.3,-1.27) 4(4.3,1.27)
R0603
  rect 0.806x0.864 smd: 1(-0.753,0) 2(0.753,0)
SMA_L4.3-W2.7-LS5.1-RD
  rect 2.1x1.8 smd: 1(-2.4,0) 2(2.4,0)
SOT-23-3_L2.9-W1.3-P1.90-LS2.4-BR
  rect 1.25x0.7 smd: 1(1,-0.95) 2(1,0.95) 3(-1,0)
SOT-23-3_L2.9-W1.6-P1.90-LS2.8-BR
  rect 1.07x0.6 smd: 1(-1.235,0.95) 2(-1.235,-0.95) 3(1.236,0)
SOT-23_L2.9-W1.3-P1.90-LS2.4-BR
  rect 1x0.8 smd: 1(1.15,-0.95) 2(1.15,0.95) 3(-1.15,0)
SRD-05VDC-SL-C_RELAY_SRD-05VDC-SL-C
  rect 1.98x1.98 hole 1.32: A1(-6.1,6)
  round 1.98 hole 1.32: A2(-6.1,-6) NC(6.1,6) NO(6.1,-6)
  round 1.935 hole 1.355x1.29: COM(-8.1,0)
UDA1334A_MODULE
  round 1.524 hole 0.914: 1(7.62,2.54) 2(5.08,2.54) 3(2.54,2.54) 4(0,2.54) 5(-2.54,2.54) 6(-5.08,2.54) 7(-7.62,2.54) 8(-10.16,2.54) 9(-12.7,2.54)
USB3.0-A-SMD_916-862A205EY10200
  rect 0.7x2.9 smd: 1(-3,1.255) 2(-1,1.255) 3(1,1.255) 4(3,1.255) 5(4,1.255) 6(2,1.255) 7(0,1.255) 8(-2,1.255) 9(-4,1.255)
  oval 1.7x3.5 hole 0.9x2.7: 10(-6.4,-1.255) 10(6.4,-1.255)
USB3.0-TH_U235-09XN-2XC2-002
  round 1.5 hole 0.9: 1(1.25,-1.09) 2(-1.25,-1.09) 3(-1.25,-4.39) 4(1.25,-4.39)
  round 1.3 hole 0.7: 5(-4.25,2.21) 6(-2.5,2.21) 7(0,2.21) 8(2.5,2.21) 9(4.25,2.21)
  round 3 hole 2.3: 10(-6,-1.61) 10(6,-1.61)
  rect 2.9x1 hole 2.5x0.6: 11(0,4.39)
WT32-ETH01-M
  round 1.524 hole 0.914: 1(-13.529,12.027) 2(-10.989,12.027) 3(-8.449,12.027) 4(-5.909,12.027) 5(-3.369,12.027) 6(-0.829,12.027) 7(1.711,12.027) 8(4.251,12.027) 9(6.791,12.027) 10(9.331,12.027) 11(11.871,12.027) 12(14.411,12.027) 13(16.951,12.027) 14(-13.529,-10.833) 15(-10.989,-10.833) 16(-8.449,-10.833) 17(-5.909,-10.833) 18(-3.369,-10.833) 19(-0.829,-10.833) 20(1.711,-10.833) 21(4.251,-10.833) 22(6.791,-10.833) 23(9.331,-10.833) 24(11.871,-10.833) 25(14.411,-10.833) 26(16.951,-10.833)

## Nets
As in the schematic.

Pads without a net: K1 NC; K2 NC; U1 1 10 13 17 24 25 26; U2 3 8; USB1 10 11; USB2 10; USB3 10 11; USB4 10

## Via types
v1: diameter 0.61, hole 0.305, Top Layer to Bottom Layer, 177 vias

## Routing (per net, layer and track width the routed paths; a pad name or vN(x,y) marks a point on that pad's centre or on a via; arc(x,y) is an arc through that point)
+3.3V: length 66.7
  Top Layer w0.5: CN5.1 CN4.1 CN3.1 CN2.1 52.08,59.95 50.55,58.42 50.55,48.26 49.02,46.74 43.49,46.74 42.99,47.24 U1.11
+3.3V_2: length 26
  Top Layer w0.254: U1.4 25.21,46.93 35.31,36.83 R2.1 R8.2
+5V: length 296.5
  Top Layer w0.6: 21.5,14.18 16.81,14.18 15.49,15.49 15.49,27.94 18.03,30.48 IC1.3 ; 21.5,14.18 21.5,20.48 21.96,20.94 D1.1 25.43,20.94 LED3.2 ; 21.5,14.18 39.84,14.18 40.39,14.73 40.39,19.77 42.2,21.59 46.74,21.59 48.51,19.81 48.51,14.48 48.93,14.06 50.4,14.06 ; 37.08,67.06 38.35,65.79 38.35,58.17 39.75,56.77 42.16,56.77 U3.4 ; 37.08,67.06 7.62,67.06 5.84,65.28 5.84,48.01 8.13,45.72 20.07,45.72 20.13,45.78 ; 37.08,67.06 90.93,67.06 91.69,66.29 U2.9 ; 66.96,14.22 65.66,14.22 64.79,15.09 64.79,20.34 63.5,21.63 58.76,21.63 57.07,19.94 57.07,14.49 56.64,14.06 50.4,14.06 ; 66.96,14.22 83.57,14.22 84.07,14.73 84.07,20.34 83.47,20.94 D2.1 80.55,19.7 LED4.2 ; 66.96,14.22 K2.A1 ; 50.4,14.06 50.45,14.11 K1.A1 ; U1.2 20.13,45.78 ; 20.13,45.78 20.13,35.9 18.35,34.12 IC1.3 ; IC1.3 17.91,34.25 LED-POWER1.1 12.95,32.7
AGND: length 33.8
  Top Layer w0.254: U3.2 44.07,63.75 73.41,63.75 73.91,64.26 U2.2
GND: length 11.7
  Top Layer w0.718: 65.71,42.94 v1(65.71,39.87) ; USB2.4 v1(87.17,39.88) ; 68.71,42.94 v1(68.71,45.71) ; USB2.7 v1(90.17,45.72)
  vias: v1(5.44,44.3) v1(5.44,39.22) v1(5.44,34.14) v1(5.44,29.06) v1(5.44,23.98) v1(5.44,18.9) v1(10.52,64.62) v1(10.52,49.38) v1(10.52,44.3) v1(10.52,29.06) v1(10.52,23.98) v1(10.52,18.9) v1(15.6,64.62) v1(15.6,59.54) v1(15.6,54.46) v1(15.6,49.38) v1(15.6,44.3) v1(15.6,39.22) v1(20.68,23.98) v1(20.68,18.9) v1(25.76,64.62) v1(25.76,59.54) v1(25.76,54.46) v1(25.76,39.22) v1(25.76,34.14) v1(25.76,29.06) v1(25.76,23.98) v1(30.84,59.54) v1(30.84,34.14) v1(30.84,30.58) v1(30.99,62.99) v1(35.81,17.53) v1(35.81,15.54) v1(35.92,39.22) v1(41,39.22) v1(41,34.14) v1(41,29.06) v1(46.08,39.22) v1(46.08,34.14) v1(46.08,29.06) v1(49.28,56.64) v1(49.28,52.61) v1(49.53,59.94) v1(51.16,39.22) v1(51.16,34.14) v1(51.16,29.06) v1(51.16,18.9) v1(52.58,57.66) v1(56.24,54.46) v1(56.24,49.38) v1(56.24,44.3) v1(56.24,39.22) v1(56.24,34.14) v1(56.24,29.06) v1(59.18,58.67) v1(61.32,54.46) v1(61.32,29.06) v1(66.4,49.38) v1(66.4,39.22) v1(66.4,23.98) v1(66.4,18.9) v1(70.1,15.75) v1(71.48,54.46) v1(71.48,49.38) v1(71.48,39.22) v1(71.48,23.98) v1(71.91,21.84) v1(72.14,17.53) v1(72.3,19.18) v1(74.28,41.02) v1(74.28,38.25) v1(75.44,63.75) v1(76.56,29.06) v1(76.56,23.98) v1(78.23,21.84) v1(81.64,29.06) v1(81.64,23.98) v1(81.64,18.9) v1(82.3,62.74) v1(86.72,39.22) v1(86.72,34.14) v1(86.72,29.06) v1(86.72,23.98) v1(86.72,18.9) v1(91.8,54.46) v1(91.8,49.38) v1(91.8,23.98) v1(91.8,18.9) v1(92.2,39.88) v1(95.68,41.02) v1(95.68,38.22) v1(96.88,64.62) v1(96.88,29.06) v1(96.88,23.98) v1(96.88,18.9) v1(101.96,59.54) v1(101.96,54.46) v1(101.96,49.38) v1(101.96,44.3) v1(101.96,39.22) v1(101.96,34.14) v1(101.96,29.06) v1(101.96,23.98) v1(101.96,18.9)
VCC: length 14.7
  Top Layer w0.6: J1.1 10.11,40.85 11.18,41.91 12.89,41.91 12.95,41.85 16.83,41.85 18.03,40.64 18.03,39.2
GPIO2: length 92.3
  Top Layer w0.254: U1.15 20.13,33.59 21.34,34.8 21.34,49.02 20.57,49.78 17.27,49.78 16.26,50.8 16.26,57.15 17.27,58.17 20.07,58.17 21.17,59.27 21.17,65.11 22.1,66.04 35.31,66.04 35.99,65.35 35.99,53.67 37.08,52.58 43.43,52.58 44.45,53.59 44.45,59.18 44.2,59.44 U3.3
GPIO4: length 10.5
  Top Layer w0.254: U1.16 22.67,23.56 23.37,22.86 26.67,22.86 28.71,20.82 R5.2
GPIO5: length 128.7
  Top Layer w0.254: CN4.2 82.09,57.45 81.28,56.64 81.28,53.59 80.52,52.83 55.12,52.83 53.09,50.8 53.09,47.24 50.29,44.45 34.29,44.45 32.83,45.91 U1.7 34.77,50.17 45.34,50.17 46.99,51.82 46.99,60.96 48.26,62.23 81.03,62.23 81.53,62.74 U2.5
GPIO12: length 52.8
  Top Layer w0.254: U1.18 27.75,23.56 28.45,22.86 64.52,22.86 66.8,20.57 75.95,20.57 76.7,19.82 R6.2
GPIO14: length 61.2
  Top Layer w0.254: R17.2 86.18,25.39 LED5.2 84.55,24.1 83.82,23.37 30.88,23.37 30.29,23.97 U1.19 30.29,27.43 R22.1
GPIO15: length 36.2
  Top Layer w0.254: R18.2 64.77,25.39 LED6.2 63.12,24.51 62.48,23.88 33.53,23.88 32.83,24.58 U1.20 32.81,25.38 R23.1
GPIO17: length 142.9
  Top Layer w0.254: U2.4 78.99,63.5 78.49,62.99 47.75,62.99 46.23,61.47 46.23,52.07 44.96,50.8 33.53,50.8 30.95,48.22 U1.6 30.29,45.41 32,43.69 50.55,43.69 53.85,46.99 53.85,50.55 55.37,52.07 90.17,52.07 90.93,52.83 90.93,56.64 91.74,57.45 CN5.2
GPIO32: length 38.2
  Top Layer w0.254: CN2.2 54.15,57.45 51.56,54.86 51.56,47.75 49.72,45.91 38.67,45.91 37.91,46.68 U1.9
GPIO33: length 114.7
  Top Layer w0.254: U2.6 84.07,61.98 83.57,61.47 48.61,61.47 47.75,60.61 47.75,51.56 45.72,49.53 36.67,49.53 U1.8 35.37,46.17 36.32,45.21 50.04,45.21 52.32,47.5 52.32,51.05 54.86,53.59 69.6,53.59 70.36,54.36 70.36,56.64 71.17,57.45 CN3.2
GPIO36: length 38.2
  Top Layer w0.254: U1.21 35.31,25.42 R2.2 35.06,27.69 34.29,27.69 34.04,27.94 34.04,36.58 23.88,46.74 23.88,49.28 21.46,51.69 21.46,53.97 20.7,54.74 OP1.4
GPIO39: length 35.5
  Top Layer w0.254: OP2.4 25.65,52.32 26.42,51.56 26.42,47.24 36.4,37.26 36.4,31.41 37.25,30.57 38.26,30.57 39.12,29.72 39.12,28.19 38.61,27.69 38.09,27.69 R8.1 37.85,25.42 U1.22
ROUT: length 29.5
  Top Layer w0.254: U2.1 70.36,64.52 U3.1
USBSW1_D+: length 6.3
  Top Layer w0.718: USB1.3 91.18,37.66 89.71,39.13 89.71,40.23 89.17,40.77 USB2.3
USBSW1_D-: length 10.6
  Top Layer w0.718: USB1.2 92.68,35.62 92.68,38.19 91.94,38.92 91.22,38.92 90.63,39.52 90.63,40.23 91.17,40.77 USB2.2
USBSW1_SSRX+: length 32.9
  Top Layer w0.718: USB2.9 94.17,45.11 93.63,45.65 93.63,47.23 94.35,47.95 97.68,47.95 98.4,47.23 98.4,43.6 97.89,43.1 97.66,43.1 97.16,42.59 97.16,42.08 97.66,41.57 97.89,41.57 98.4,41.06 98.4,40.56 97.89,40.05 97.66,40.05 97.16,39.54 97.16,39.03 97.66,38.52 97.89,38.52 98.4,38.02 98.4,33.63 97.28,32.51 94.12,32.51 USB1.6
USBSW1_SSRX-: length 32.7
  Top Layer w0.718: USB2.8 92.17,45.11 92.71,45.65 92.71,47.61 93.97,48.87 98.06,48.87 99.32,47.61 99.32,33.25 97.66,31.59 94.95,31.59 USB1.5
USBSW1_SSTX+: length 33
  Top Layer w0.718: USB2.6 88.17,45.11 87.63,45.65 87.63,47.61 86.37,48.87 82.06,48.87 81.01,47.82 81.01,33 82.27,31.74 85.24,31.74 USB1.9
USBSW1_SSTX-: length 32.9
  Top Layer w0.718: 87.67,30.95 87.67,30.96 87.67,31.2 86.21,32.67 82.65,32.67 81.93,33.38 81.93,37.88 82.44,38.39 82.55,38.39 83.06,38.89 83.06,39.4 82.55,39.91 82.44,39.91 81.93,40.42 81.93,40.93 82.44,41.44 82.55,41.44 83.06,41.94 83.06,42.45 82.55,42.96 82.44,42.96 81.93,43.47 81.93,47.44 82.44,47.95 85.99,47.95 86.71,47.23 86.71,45.65 86.17,45.11 USB2.5
USBSW1_VBUS1: length 14.1
  Top Layer w0.3: R20.2 90.53,25.39 90.02,24.87 89.23,24.87 88.8,25.31 88.8,27.59 88.6,27.79
  Top Layer w0.5: 87.96,28.43 88.6,27.79
  Top Layer w0.6: Q6.2 92.46,25.39 R20.2
  Top Layer w0.718: USB1.1 88.92,30.5 87.96,29.54 87.96,28.43
USBSW1_VBUS2: length 21.9
  Top Layer w0.718: USB2.1 93.17,40.5 93.98,39.69 93.98,34.54 91.43,32 91.43,30.49 92.48,29.44 94.06,29.44 94.96,28.55 Q6.3 C3.2
USBSW2_D+: length 6.3
  Top Layer w0.718: USB3.3 69.72,37.66 68.25,39.13 68.25,40.23 67.71,40.77 67.71,42.94
USBSW2_D-: length 10.6
  Top Layer w0.718: 69.71,42.94 69.71,40.77 69.18,40.23 69.18,39.51 69.77,38.92 70.49,38.92 71.23,38.18 71.23,35.62 USB3.2
USBSW2_SSRX+: length 32.9
  Top Layer w0.718: 72.71,42.94 72.71,45.1 72.18,45.64 72.18,47.23 72.89,47.94 76.23,47.94 76.94,47.23 76.94,43.6 76.44,43.09 76.21,43.09 75.7,42.58 75.7,42.07 76.21,41.57 76.44,41.57 76.94,41.06 76.94,40.55 76.44,40.04 76.21,40.04 75.7,39.53 75.7,39.03 76.21,38.52 76.44,38.52 76.94,38.01 76.94,33.62 75.83,32.51 72.66,32.51 USB3.6
USBSW2_SSRX-: length 32.7
  Top Layer w0.718: 70.71,42.94 70.71,45.1 71.25,45.64 71.25,47.61 72.51,48.86 76.61,48.86 77.87,47.61 77.87,33.24 76.21,31.59 73.49,31.59 USB3.5
USBSW2_SSTX+: length 33
  Top Layer w0.718: 66.71,42.94 66.71,45.1 66.18,45.64 66.18,47.61 64.92,48.86 60.61,48.86 59.56,47.82 59.56,33 60.82,31.74 63.78,31.74 USB3.9
USBSW2_SSTX-: length 32.9
  Top Layer w0.718: 66.22,30.95 66.22,30.95 66.22,31.2 64.75,32.66 61.2,32.66 60.48,33.38 60.48,37.87 60.99,38.38 61.09,38.38 61.6,38.89 61.6,39.4 61.09,39.91 60.99,39.91 60.48,40.41 60.48,40.92 60.99,41.43 61.09,41.43 61.6,41.94 61.6,42.45 61.09,42.95 60.99,42.95 60.48,43.46 60.48,47.44 60.99,47.94 64.54,47.94 65.25,47.23 65.25,45.64 64.71,45.1 64.71,42.94
USBSW2_VBUS1: length 14.1
  Top Layer w0.3: 67.16,27.79 67.36,27.59 67.36,25.3 67.8,24.87 68.58,24.87 69.1,25.38 69.83,25.38
  Top Layer w0.5: 66.53,28.42 67.16,27.79
  Top Layer w0.718: 67.48,34.36 67.48,30.53 66.53,29.57 66.53,28.42 ; Q7.2 71.04,25.39 R21.2
USBSW2_VBUS2: length 21.8
  Top Layer w0.718: 71.71,42.94 71.71,40.49 72.39,39.82 72.39,34.54 69.98,32.13 69.98,30.48 71.02,29.44 72.6,29.44 73.5,28.54 73.5,26.14 ; Q7.3 C4.2
$1N3: length 21.6
  Top Layer w0.254: 30.19,15.24 25.4,15.24 24.5,16.14 D1.2 ; 30.19,15.24 30.22,15.27 R12.2 ; 30.19,15.24 33.53,15.24 34.38,16.09 Q1.3 37.85,18.54 38.35,18.03 38.35,15.72 K1.A2
$1N5: length 3.3
  Top Layer w0.254: Q1.1 31.72,19.3 R5.1 R10.2
$1N16: length 1.5
  Top Layer w0.6: LED-POWER1.2 12.95,37.35
$1N18: length 36.8
  Top Layer w0.254: K2.A2 55.25,15.62 56.13,16.51 56.13,20.32 58.17,22.35 64.01,22.35 66.42,19.94 70.49,19.94 71.03,19.4 Q2.3 ; 71.12,18.45 71.12,17.02 71.88,16.26 R13.2 75.19,15.49 75.44,15.24 80.89,15.24 D2.2
$1N19: length 3.2
  Top Layer w0.254: R13.1 78.49,16.26 78.87,16.64 LED4.1
$1N25: length 3.3
  Top Layer w0.254: Q2.1 75,17.59 R11.2 R6.1
$1N58: length 3
  Top Layer w0.254: OP1.1 9.65,54.88 R1.1
$1N59: length 5.7
  Top Layer w0.254: CN1.4 10.39,60.71 10.31,60.63 LED1.2 9.66,59.18 R1.2
$1N4552: length 10
  Top Layer w3: JP2.3 JP2.4
  Bottom Layer w3: JP2.3 JP2.4
  vias: v1(85.01,8.51) v1(85.01,6.87)
$1N4588: length 18.2
  Top Layer w2.5: JP1.6 32.82,4.64 34.04,3.43 K1.NO
  Bottom Layer w2.5: JP1.6 32.82,4.64 34.04,3.43 K1.NO
  vias: v1(32.38,5.72) v1(33.02,3.81) v1(33.66,5.08) v1(34.29,2.54) v1(34.93,3.81) v1(36.19,2.54) v1(36.83,3.81)
$1N4592: length 49.6
  Top Layer w2.5: K1.COM 44.45,10.79 31,10.79 27.82,7.62
  Bottom Layer w2.5: 27.82,7.62 31,10.79 44.45,10.79 K1.COM
  vias: v1(28.57,9.53) v1(30.48,9.53) v1(31.12,11.43) v1(32.38,10.16) v1(33.65,11.59) v1(34.29,10.16) v1(36.19,11.43) v1(37.47,10.16) v1(39.37,11.43) v1(40.64,10.16) v1(42.54,11.43) v1(43.81,15.24) v1(43.81,12.7) v1(44.83,10.79) v1(45.09,15.88) v1(45.09,13.97)
$1N4597: length 10
  Top Layer w3: JP1.3 JP1.4
  Bottom Layer w3: JP1.3 JP1.4
  vias: v1(20.24,8.4) v1(20.24,6.71)
$1N4602: length 10
  Top Layer w3: JP1.1 JP1.2
  Bottom Layer w3: JP1.1 JP1.2
  vias: v1(10.16,8.25) v1(10.16,6.76)
$1N4658: length 49.5
  Top Layer w2.5: K2.COM 60.96,10.79 74.41,10.79 JP2.2
  Bottom Layer w2.5: K2.COM 60.96,10.79 74.41,10.79 JP2.2
  vias: v1(60.32,15.24) v1(60.32,12.7) v1(60.32,10.79) v1(61.59,15.88) v1(61.59,13.97) v1(61.59,12.06) v1(62.87,11.45) v1(62.87,10.16) v1(64.77,11.43) v1(64.77,10.16) v1(66.7,11.43) v1(66.7,10.08) v1(68.58,11.43) v1(68.58,10.16) v1(70.5,11.57) v1(70.5,10.18) v1(72.44,11.49) v1(72.39,10.16) v1(73.66,11.43) v1(74.29,10.16) v1(75.56,10.75) v1(75.56,8.89) v1(76.84,9.53)
$1N4661: length 38.7
  Top Layer w2.5: K2.NO 59.16,7.62 JP2.1
  Bottom Layer w2.5: JP2.1 59.16,7.62 K2.NO
  vias: v1(55.88,5.08) v1(57.57,6.78) v1(57.57,5.08) v1(59.16,8.25) v1(59.37,6.78) v1(60.96,8.25) v1(60.96,6.99) v1(62.87,8.25) v1(62.87,6.99) v1(65.41,8.25) v1(65.41,6.91) v1(67.31,8.25) v1(67.31,6.92) v1(69.82,8.35) v1(69.82,6.94)
$1N4663: length 10
  Top Layer w3: JP2.5 JP2.6
  Bottom Layer w3: JP2.5 JP2.6
  vias: v1(95.25,8.25) v1(95.25,6.82)
$1N12669: length 26.6
  Top Layer w0.254: OP1.2 8.76,52.2 8.13,52.83 8.13,64.52 8.88,65.27 R3.1 11.44,65.27 14.48,62.23 17.36,62.23 CN1.3
$1N27876: length 24.5
  Top Layer w0.254: 23.89,60.7 23.89,60.96 25.21,62.28 28.25,62.28 31.27,65.29 33.22,65.29 ; 33.28,65.14 34.14,65.14 34.8,64.48 34.8,55.37 34.29,54.86 OP2.2
$1N27969: length 1.5
  Top Layer w0.254: R3.2 LED1.1
$1N27997: length 6
  Top Layer w0.254: R9.1 33.28,58.92 LED2.2 32.62,60.41 32.33,60.71 CN1.1
$1N28002: length 8
  Top Layer w0.254: OP2.1 32.25,52.32 30.73,53.84 30.73,56.13 32.01,57.41 R9.2
$1N28006: length 1.8
  Top Layer w0.254: R4.1 33.27,62.02 LED2.1
$1N30826: length 3.1
  Top Layer w0.254: LED3.1 26.67,16.51 26.92,16.26 R12.1
$1N38985: length 1.6
  Top Layer w0.254: Q3.1 87.53,26.89 R17.1
$1N38986: length 3.3
  Top Layer w0.254: Q6.1 92.46,26.89 R20.1 90.48,26.89 Q3.3
$1N41846: length 1.6
  Top Layer w0.254: R18.1 66.11,26.89 Q4.1
$1N41847: length 3.3
  Top Layer w0.254: Q7.1 71.04,26.89 R21.1 69.06,26.89 Q4.3
$1N49685: length 1.7
  Top Layer w0.254: R14.2 84.44,26.89 LED5.1
$1N49709: length 1.7
  Top Layer w0.254: R15.2 63.02,26.89 LED6.1

## Copper pours and planes (outline as drawn; the poured copper is in the pictures)
GND on Top Layer: 64.39,20.2 64.39,13.9 105.66,13.74 105.66,68.58 0,68.58 0,13.72 40.89,13.72 40.89,19.81 42.42,21.34 46.48,21.34 48.26,19.56 48.26,13.72 57.4,13.72 57.4,19.81 58.92,21.34 63.34,21.34
GND on Bottom Layer: 64.39,20.2 64.39,13.9 105.66,13.74 105.66,68.58 0,68.58 0,13.72 40.89,13.72 40.89,19.81 42.42,21.34 46.48,21.34 48.26,19.56 48.26,13.72 57.4,13.72 57.4,19.81 58.92,21.34 63.34,21.34

## Text on the board
Top Silkscreen Layer: JLCJLCJLCJLC | POWER | USB Switch 2 | GND | DHT22 | USB Switch 1 | Input 1 | Input 2 | VCC | 1 | 2 | Input 3V-24V | rev. 2 | N | E | L | O | O1 | O2
